# Altium project Controller.PrjPCB
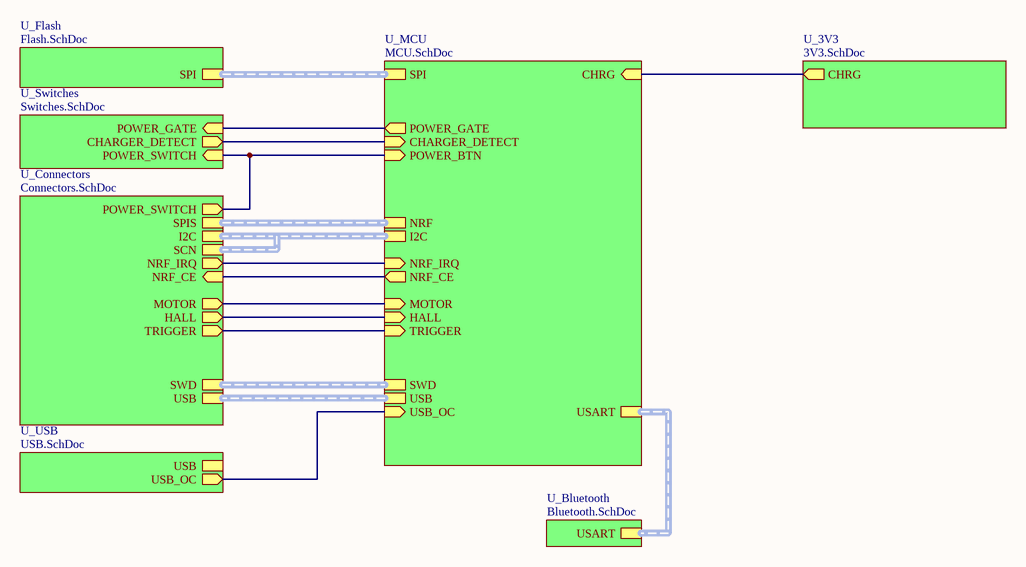
[diagram p0: Controller.SchDoc]
8 sheets, 109 parts. Net scope: hierarchical (ports join the sheet entries above them; power ports are global).
Board file: Controller.PcbDoc
Sheets:
  Controller.SchDoc
    U_3V3 = 3V3.SchDoc
    U_MCU = MCU.SchDoc
    U_Switches = Switches.SchDoc
    U_Connectors = Connectors.SchDoc
    U_Bluetooth = Bluetooth.SchDoc
    U_Flash = Flash.SchDoc
    U_USB = USB.SchDoc

## Sheet Controller.SchDoc
size A; SheetNumber: 1

### Sub-sheets
U_3V3 = 3V3.SchDoc: CHRG (out)
U_Bluetooth = Bluetooth.SchDoc: USART (harness USART2)
U_Connectors = Connectors.SchDoc: POWER_SWITCH (out), SWD (harness SWD), HALL (out), USB, SPIS (harness SPI), I2C (harness I2C), SCN (harness I2C), MOTOR (out), NRF_IRQ (out), NRF_CE (in), TRIGGER (out)
U_Flash = Flash.SchDoc: SPI (harness SPI)
U_MCU = MCU.SchDoc: POWER_BTN (in), POWER_GATE (out), USB (harness USB), I2C (harness I2C), USART (harness USART2), SPI, SWD (harness SWD), USB_OC (in), CHARGER_DETECT (in), NRF, HALL (in), MOTOR (in), NRF_IRQ (in), NRF_CE (out), TRIGGER (in), CHRG (in)
U_Switches = Switches.SchDoc: POWER_GATE (in), POWER_SWITCH (in), CHARGER_DETECT (out)
U_USB = USB.SchDoc: USB_OC (out), USB (harness USB)

### Nets
NetC2_2: sheet U_MCU/HALL, sheet U_Connectors/HALL
NetC15_2: sheet U_MCU/POWER_BTN, sheet U_Switches/POWER_SWITCH, sheet U_Connectors/POWER_SWITCH
NetC16_2: sheet U_MCU/TRIGGER, sheet U_Connectors/TRIGGER
NetD3_2: sheet U_MCU/MOTOR, sheet U_Connectors/MOTOR
NetD22_C: sheet U_MCU/USB_OC, sheet U_USB/USB_OC
NetJP1_3: sheet U_MCU/NRF_CE, sheet U_Connectors/NRF_CE
NetJP1_8: sheet U_MCU/NRF_IRQ, sheet U_Connectors/NRF_IRQ
NetQ4_1: sheet U_MCU/CHARGER_DETECT, sheet U_Switches/CHARGER_DETECT
NetQ11_1: sheet U_MCU/POWER_GATE, sheet U_Switches/POWER_GATE
NetR10_1: sheet U_3V3/CHRG, sheet U_MCU/CHRG

### Buses and harness runs
harness sheet U_Bluetooth/USART = sheet U_MCU/USART
harness sheet U_Connectors/I2C = sheet U_Connectors/SCN = sheet U_MCU/I2C
harness sheet U_Connectors/SPIS = sheet U_MCU/NRF
harness sheet U_Connectors/SWD = sheet U_MCU/SWD
harness sheet U_Connectors/USB = sheet U_MCU/USB
harness sheet U_Flash/SPI = sheet U_MCU/SPI

## Sheet 3V3.SchDoc
size A; SheetNumber: 2
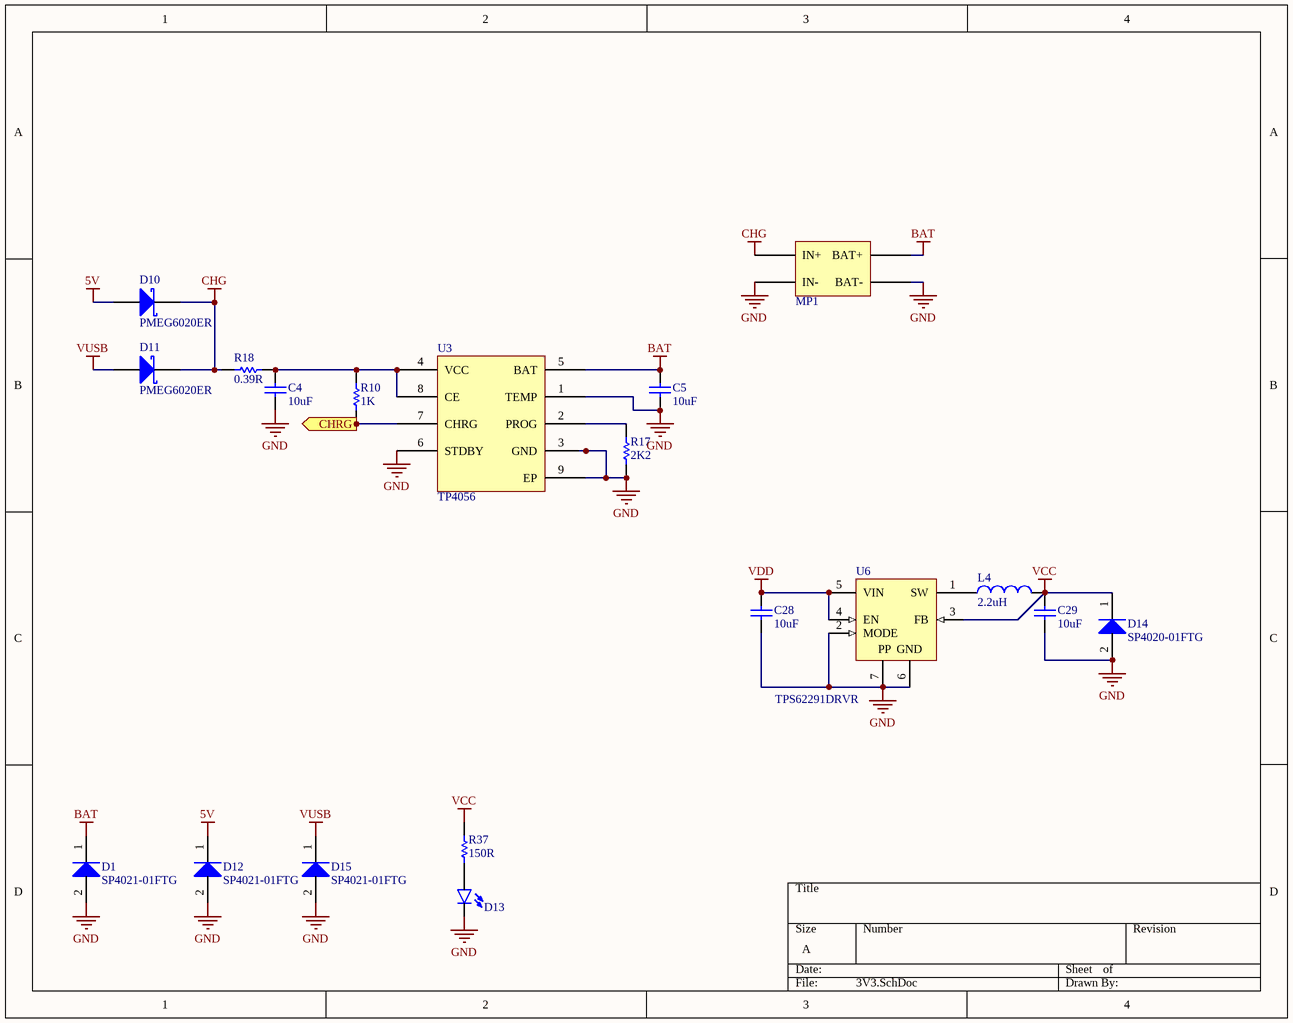
[diagram p1: 3V3.SchDoc]

### Parts
C4  value 10uF  [C1206[3216X160]]  (hidden comment: 10uF 50V 1206)
C5  value 10uF  [C1206[3216X160]]  (hidden comment: 10uF 50V 1206)
C28  value 10uF  [C0603[1608X92]]  (hidden comment: 10uF 16V 0603)
C29  value 10uF  [C0603[1608X92]]  (hidden comment: 10uF 6.3V 0603)
D1  SP4021-01FTG  [SOD-323]
D10  PMEG6020ER  [SOD-123]
D11  PMEG6020ER  [SOD-123]
D12  SP4021-01FTG  [SOD-323]
D13  LED_0603_GREEN_5mA  [LED0603]  (value not drawn)
D14  SP4020-01FTG  [SOD-323]
D15  SP4021-01FTG  [SOD-323]
L4  2.2uH  [IND0805]
MP1  Li-ion CHARGER  [LI-ION CHARGER]  (value not drawn)
R10  value 1K  [R0603[1608]]  (hidden comment: 1K 1% 0603)
R17  value 2K2  [R0603[1608]]  (hidden comment: 2K2 1% 0603)
R18  value 0.39R  [R1206[3216]]  (hidden comment: 0.39R 1% 1206)
R37  value 150R  [R0603[1608]]  (hidden comment: 150R 1% 0603)
U3  TP4056  [SOIC-8-EP]
U6  TPS62291DRVR  [WSON-6]

### Ports
CHRG (out)

### Nets
5V: D10.2(A) D12.1(K)
BAT: C5.2 D1.1(K) MP1.3(BAT+) U3.5(BAT)
CHG: D10.1(K) D11.1(K) MP1.1(IN+) R18.2
GND: C4.1 C5.1 C28.1 C29.1 D1.2(A) D12.2(A) D13.C D14.2(A) D15.2(A) MP1.2(IN-) MP1.4(BAT-) R17.1 U3.1(TEMP) U3.3(GND) U3.6(STDBY) U3.9(EP) U6.2(MODE) U6.6(GND) U6.7(EP)
VCC: C29.2 D14.1(K) L4.2 R37.2 U6.3(FB)
VDD: C28.2 U6.4(EN) U6.5(VIN)
VUSB: D11.2(A) D15.1(K)
NetC4_2: C4.2 R10.2 R18.1 U3.4(VCC) U3.8(CE)
NetD13_A: D13.A R37.1
NetL4_1: L4.1 U6.1(SW)
NetR10_1: R10.1 U3.7(CHRG) ; port CHRG
NetR17_2: R17.2 U3.2(PROG)

### Notes on the sheet
- (in symbol TPS62291DRVR) PP

### Library data of the parts
C4 C5 = CAP_10uF_50V_1206_20%: 10uF 50V 20% 1206 (3216 Metric); PartNumber: UMK316BBJ106ML-T; Manufacturer: Taiyo Yuden; Mounting Technology: Surface Mount; PackageReference: 1206; PackageDescription: 1206 (3216 Metric); Voltage: 50V; Tolerance: 20%
C28 = CAP_10uF_16V_0603_10%: 10uF 16V 10% 0603 (1608 Metric); PartNumber: GRM188R61C106KAALD; Manufacturer: Murata; TemperatureCoefficient: X5R; Mounting Technology: Surface Mount; PackageReference: 0603; PackageDescription: 0603 (1608 Metric); Voltage: 16V; Tolerance: 10%
C29 = CAP_10uF_6.3V_0603_10%: 10uF 6.3V 10% 0603 (1608 Metric); PartNumber: GRM188R60J106KE47D; Manufacturer: Murata; TemperatureCoefficient: X5R; Mounting Technology: Surface Mount; PackageReference: 0603; PackageDescription: 0603 (1608 Metric); Voltage: 6.3V; Tolerance: 10%
D1 D12 D15 = SP4021-01FTG: Manufacturer: Littelfuse; PartNumber: SP4021-01FTG; PackageReference: SOD-323-2; Mounting Technology: Surface Mount
D10 D11 = PMEG6020ER: PartNumber: PMEG6020ER,115; Manufacturer: NXP Semiconductors; PackageReference: SOD-123W; PackageDescription: SOD, 2-Leads, Body 2.69x1.6mm; Mounting Technology: Surface Mount
D13 = LED_0603_GREEN_5mA: PartNumber: LTST-C193TGKT-5A; Manufacturer: Lite-On Inc.; PackageReference: 0603; PackageDescription: 0603 (1608 Metric); Mounting Technology: Surface Mount
D14 = SP4020-01FTG: Manufacturer: Littelfuse; PartNumber: SP4020-01FTG; PackageReference: SOD-323-2; Mounting Technology: Surface Mount
L4 = IND_2.2uH_1.7A_0805_20%: 2.2uH 20% 1.7A 0805; PartNumber: LQM21PN2R2MGHL; Manufacturer: Murata; PackageReference: 0805; PackageDescription: 0805 (2012 metric); Value: 2.2uH; Mounting Technology: Surface Mount; Current: 1.7A
MP1 = Li-ion CHARGER: TP4056 LI-ION, LI-POLYMER 1-CELL CHARGER; Manufacturer: ELEPARTS; PartNumber: Micro USB 1A
R10 = RES_1K_0603_1%: 1K 0.25W 1% 0603 (1005 Metric); Manufacturer: Vishay / Dale; PartNumber: CRCW06031K00FKEAHP; Tolerance: 1%; Power: 0.25W; Mounting Technology: Surface Mount; PackageReference: 0603; PackageDescription: 0603 (1608 Metric); ComponentLink1Description: Datasheet; ComponentLink1URL: http://www.vishay.com/docs/20043/crcwhpe3.pdf
R17 = RES_2K2_0603_1%: 2K2 0.25W 1% 0603 (1005 Metric); Manufacturer: Vishay / Dale; PartNumber: CRCW06032K20FKEAHP; Tolerance: 1%; Power: 0.25W; Mounting Technology: Surface Mount; PackageReference: 0603; PackageDescription: 0603 (1608 Metric); ComponentLink1Description: Datasheet; ComponentLink1URL: http://www.vishay.com/docs/20043/crcwhpe3.pdf
R18 = RES_0.39R_1206_1%: 0.39R 0.5W 1% 1206 (3216 Metric); Manufacturer: Vishay Dale; PartNumber: RCWE1206R390FKEA; Tolerance: 1%; Power: 0.5W; Mounting Technology: Surface Mount; PackageReference: 1206; PackageDescription: 1206 (3216 Metric); ComponentLink1Description: Datasheet; ComponentLink1URL: https://industrial.panasonic.com/cdbs/www-data/pdf/RDA0000/AOA0000C239.pdf
R37 = RES_150R_0603_1%: 150R 0.25W 1% 0603 (1005 Metric); Manufacturer: Vishay / Dale; PartNumber: CRCW0603150RFKEAHP; Tolerance: 1%; Power: 0.25W; Mounting Technology: Surface Mount; PackageReference: 0603; PackageDescription: 0603 (1608 Metric); ComponentLink1Description: Datasheet; ComponentLink1URL: http://www.vishay.com/docs/20043/crcwhpe3.pdf
U3 = TP4056: 1 CELL Li-ion Battery Charger; Manufacturer: Nanjing Extension Microelectronics; PartNumber: TP4056; PackageReference: SOP-8; Mounting Technology: Surface Mount
U6 = TPS62291DRVR: Voltage Regulators - Switching Regulators 2.25MHz 1A Step-Down Cnvrtr 3.3V Output; Manufacturer: Texas Instruments; PartNumber: TPS62291DRVR; PackageReference: WSON-6; PackageDescription: SON, 6-Leads, Body 2x2mm, Pitch 0.65mm, Thermal Pad 1.6x1mm, TI Recommended; Mounting Technology: Surface Mount

## Sheet MCU.SchDoc
size A3; SheetNumber: 3
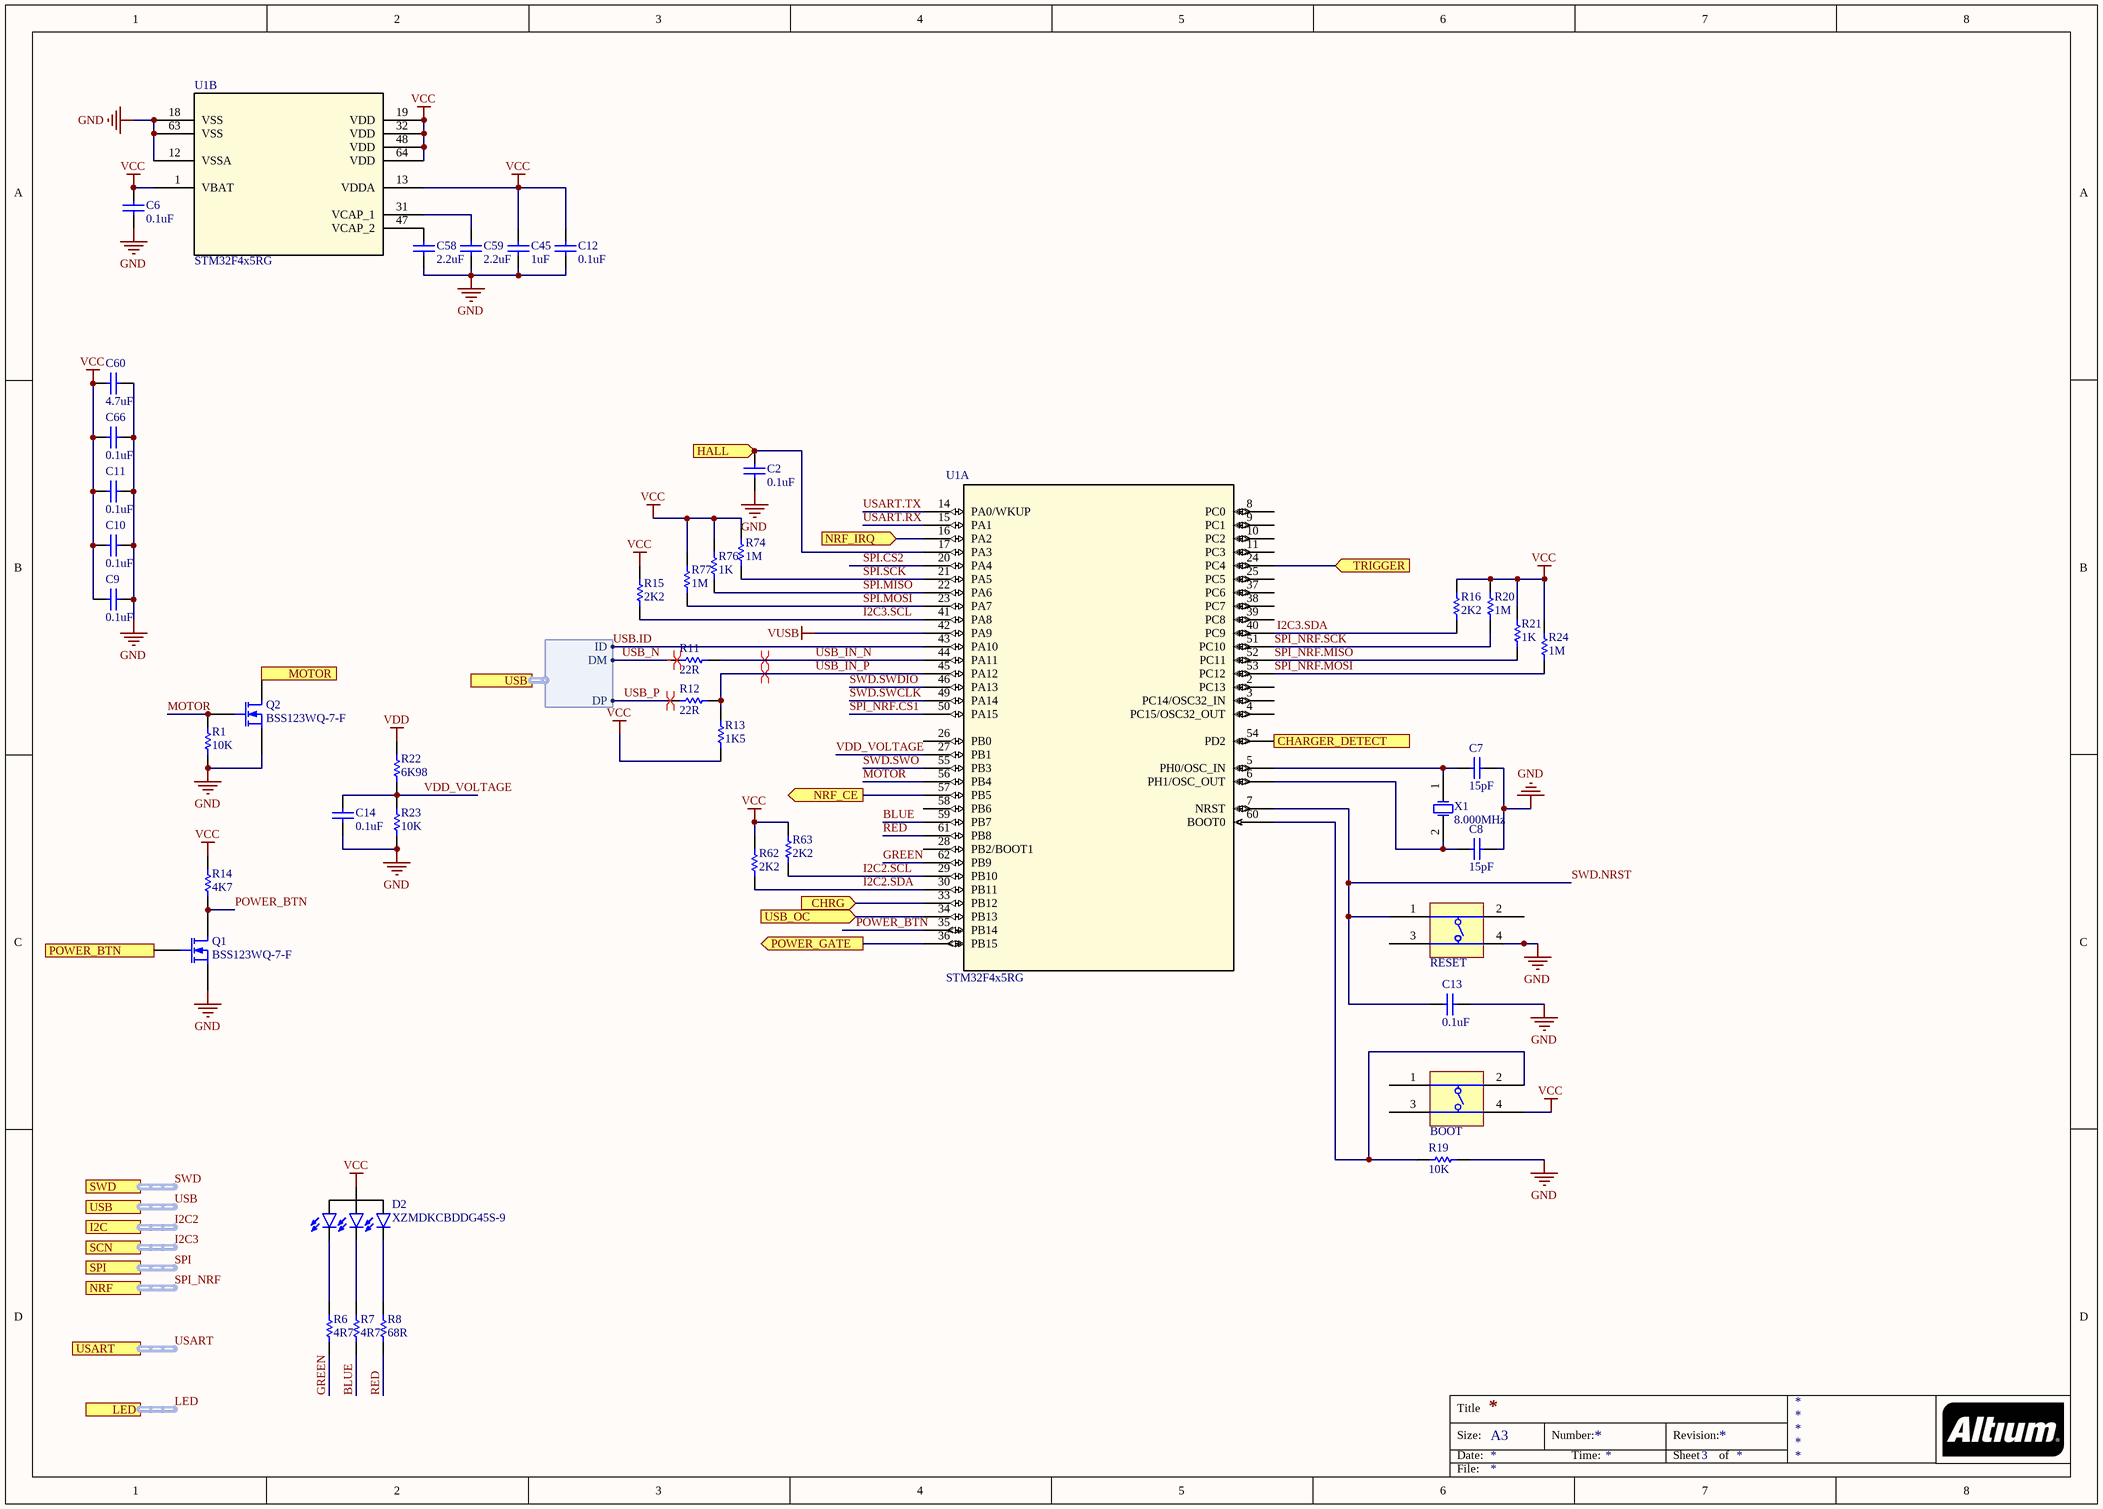
[diagram p2: MCU.SchDoc]

### Parts
BOOT  DIPT-DTSM-6  [SWITCH]  (value not drawn)
C2  value 0.1uF  [C0603[1608X92]]  (hidden comment: 0.1uF 6.3V 0603)
C6  value 0.1uF  [C0603[1608X92]]  (hidden comment: 0.1uF 6.3V 0603)
C7  value 15pF  [C0603[1608X92]]  (hidden comment: 15pF 50V 0603)
C8  value 15pF  [C0603[1608X92]]  (hidden comment: 15pF 50V 0603)
C9  value 0.1uF  [C0603[1608X92]]  (hidden comment: 0.1uF 6.3V 0603)
C10  value 0.1uF  [C0603[1608X92]]  (hidden comment: 0.1uF 6.3V 0603)
C11  value 0.1uF  [C0603[1608X92]]  (hidden comment: 0.1uF 6.3V 0603)
C12  value 0.1uF  [C0603[1608X92]]  (hidden comment: 0.1uF 6.3V 0603)
C13  value 0.1uF  [C0603[1608X92]]  (hidden comment: 0.1uF 6.3V 0603)
C14  value 0.1uF  [C0603[1608X92]]  (hidden comment: 0.1uF 6.3V 0603)
C45  value 1uF  [C0603[1608X92]]  (hidden comment: 1uF 6.3V 0603)
C58  value 2.2uF  [C1206[3216X160]]  (hidden comment: 2.2uF 6.3V 1206)
C59  value 2.2uF  [C1206[3216X160]]  (hidden comment: 2.2uF 6.3V 1206)
C60  value 4.7uF  [C0603[1608X92]]  (hidden comment: 4.7uF 6.3V 0603)
C66  value 0.1uF  [C0603[1608X92]]  (hidden comment: 0.1uF 6.3V 0603)
D2  XZMDKCBDDG45S-9  [XZMDKCBDDG45S-9]
Q1  BSS123WQ-7-F  [SOT323-3]
Q2  BSS123WQ-7-F  [SOT323-3]
R1  value 10K  [R0603[1608]]  (hidden comment: 10K 1% 0603)
R6  value 4R7  [R0603[1608]]  (hidden comment: 4R7 5% 0603)
R7  value 4R7  [R0603[1608]]  (hidden comment: 4R7 5% 0603)
R8  value 68R  [R0603[1608]]  (hidden comment: 68R 1% 0603)
R11  value 22R  [R0603[1608]]  (hidden comment: 22R 1% 0603)
R12  value 22R  [R0603[1608]]  (hidden comment: 22R 1% 0603)
R13  value 1K5  [R0603[1608]]  (hidden comment: 1K5 1% 0603)
R14  value 4K7  [R0603[1608]]  (hidden comment: 4K7 1% 0603)
R15  value 2K2  [R0603[1608]]  (hidden comment: 2K2 1% 0603)
R16  value 2K2  [R0603[1608]]  (hidden comment: 2K2 1% 0603)
R19  value 10K  [R0603[1608]]  (hidden comment: 10K 1% 0603)
R20  value 1M  [R0603[1608]]  (hidden comment: 1M 5% 0603)
R21  value 1K  [R0603[1608]]  (hidden comment: 1K 1% 0603)
R22  value 6K98  [R0603[1608]]  (hidden comment: 6K98 1% 0603)
R23  value 10K  [R0603[1608]]  (hidden comment: 10K 1% 0603)
R24  value 1M  [R0603[1608]]  (hidden comment: 1M 5% 0603)
R62  value 2K2  [R0603[1608]]  (hidden comment: 2K2 1% 0603)
R63  value 2K2  [R0603[1608]]  (hidden comment: 2K2 1% 0603)
R74  value 1M  [R0603[1608]]  (hidden comment: 1M 5% 0603)
R76  value 1K  [R0603[1608]]  (hidden comment: 1K 1% 0603)
R77  value 1M  [R0603[1608]]  (hidden comment: 1M 5% 0603)
RESET  DIPT-DTSM-6  [SWITCH]  (value not drawn)
U1  STM32F4x5RG  [LQFP64-10x10mm]  (parts A,B of 2)
X1  8.000MHz  [OSC_2SM_3R2x2R5]

### Ports
CHARGER_DETECT (in), CHRG (in), HALL (in), I2C (harness I2C), LED (harness LED), MOTOR (in), NRF (harness SPI), NRF_CE (out), NRF_IRQ (in), POWER_BTN (in), POWER_GATE (out), SCN (harness I2C), SPI (harness SPI), SWD (harness SWD), TRIGGER (in), USART (harness USART2), USB (harness USB), USB_OC (in)

### Harnesses
USB: DM, DP, ID

### Nets
GND: C2.1 C6.1 C7.2 C8.2 C9.2 C10.2 C11.2 C12.1 C13.2 C14.1 C45.1 C58.1 C59.1 C60.2 C66.2 Q1.2(S) Q2.2(S) R1.1 R19.2 R23.1 RESET.4 U1.12(VSSA) U1.18(VSS) U1.63(VSS)
VCC: BOOT.4 C6.2 C9.1 C10.1 C11.1 C12.2 C45.2 C60.1 C66.1 D2.2(A) R13.1 R14.2 R15.1 R16.1 R20.1 R21.1 R24.1 R62.1 R63.1 R74.1 R76.1 R77.1 U1.1(VBAT) U1.13(VDDA) U1.19(VDD) U1.32(VDD) U1.48(VDD) U1.64(VDD)
VDD: R22.2
VUSB: U1.42(PA9)
BLUE: R7.1 U1.59(PB7)
GREEN: R6.1 U1.62(PB9)
I2C2.SCL: R63.2 U1.29(PB10)
I2C2.SDA: R62.2 U1.30(PB11)
I2C3.SCL: R15.2 U1.41(PA8)
I2C3.SDA: R16.2 U1.40(PC9)
MOTOR: Q2.1(G) R1.2 U1.56(PB4)
POWER_BTN: Q1.3(D) R14.1 U1.35(PB14)
RED: R8.1 U1.61(PB8)
SPI.CS2: U1.20(PA4)
SPI.MISO: R76.2 U1.22(PA6)
SPI.MOSI: R77.2 U1.23(PA7)
SPI.SCK: R74.2 U1.21(PA5)
SPI_NRF.CS1: U1.50(PA15)
SPI_NRF.MISO: R21.2 U1.52(PC11)
SPI_NRF.MOSI: R24.2 U1.53(PC12)
SPI_NRF.SCK: R20.2 U1.51(PC10)
SWD.NRST: C13.1 RESET.1 U1.7(NRST)
SWD.SWCLK: U1.49(PA14)
SWD.SWDIO: U1.46(PA13)
SWD.SWO: U1.55(PB3)
USART.RX: U1.15(PA1)
USART.TX: U1.14(PA0/WKUP)
USB.ID: U1.43(PA10) ; port USB.ID
USB_IN_N: R11.2 U1.44(PA11)
USB_IN_P: R12.2 R13.2 U1.45(PA12)
USB_N: R11.1 ; port USB.DM  [project net USB.DM]
USB_P: R12.1 ; port USB.DP  [project net USB.DP]
VDD_VOLTAGE: C14.2 R22.1 R23.2 U1.27(PB1)
NetBOOT_2: BOOT.2 R19.1 U1.60(BOOT0)
NetC2_2: C2.2 U1.17(PA3) ; port HALL
NetC7_1: C7.1 U1.5(PH0/OSC_IN) X1.1(OSC1)
NetC8_1: C8.1 U1.6(PH1/OSC_OUT) X1.2(OSC2)
NetC15_2: Q1.1(G) ; port POWER_BTN
NetC16_2: U1.24(PC4) ; port TRIGGER
NetC58_2: C58.2 U1.47(VCAP_2)
NetC59_2: C59.2 U1.31(VCAP_1)
NetD2_1: D2.1(K_Red) R8.2
NetD2_3: D2.3(K_Blue) R7.2
NetD2_4: D2.4(K_Green) R6.2
NetD3_2: Q2.3(D) ; port MOTOR
NetD22_C: U1.34(PB13) ; port USB_OC
NetJP1_3: U1.57(PB5) ; port NRF_CE
NetJP1_8: U1.16(PA2) ; port NRF_IRQ
NetQ4_1: U1.54(PD2) ; port CHARGER_DETECT
NetQ11_1: U1.36(PB15) ; port POWER_GATE
NetR10_1: U1.33(PB12) ; port CHRG

Not connected (* = marked no-connect by the designer): BOOT 1 3; RESET 2 3; U1 2(PC13) 3(PC14/OSC32_IN) 4(PC15/OSC32_OUT) 8(PC0) 9(PC1) 10(PC2) 11(PC3) 25(PC5) 26(PB0) 28(PB2/BOOT1) 37(PC6) 38(PC7) 39(PC8) 58(PB6)

### Buses and harness runs
harness I2C2 = port I2C
harness I2C3 = port SCN
harness LED = port LED
harness SPI = port SPI
harness SPI_NRF = port NRF
harness SWD = port SWD
harness USART = port USART
harness USB = port USB

### Layout directives
differential pair; rule Width Constraint [Pref Width = 10mil    Min Width = 10mil    Max Width = 10mil]: USB.DM
differential pair: USB.DP, USB_IN_N, USB_IN_P

### Notes on the sheet
- Title
- Size:
- Date:
- A3
- Number:
- Time:
- Revision:
- Sheet
- of
- File:

### Library data of the parts
BOOT RESET = DIPT-DTSM-6: Switch, SPNO Push Button SMD; Manufacturer: C&K Components; PartNumber: PTS810 SJM 250 SMTR LFS; PackageReference: PTS810
C2 C6 C9-C14 C66 = CAP_0.1uF_6.3V_0603_10%: 0.1uF 6.3V 10% 0603 (1608 Metric); PartNumber: GRM188R70J104KA01D; Manufacturer: Murata; Mounting Technology: Surface Mount; PackageReference: 0603; PackageDescription: 0603 (1608 Metric); Voltage: 6.3V; Tolerance: 10%
C7 C8 = CAP_15pF_50V_0603_1%: 15pF 50V 1% 0603 (1608 Metric); PartNumber: 06035A150FAT2A; Manufacturer: AVX Corporation; TemperatureCoefficient: C0G; Mounting Technology: Surface Mount; PackageReference: 0603; PackageDescription: 0603 (1608 Metric); Voltage: 50V; Tolerance: 1%
C45 = CAP_1uF_6.3V_0603_10%: 1uF 6.3V 10% 0603 (1608 Metric); PartNumber: GRM188R60J105KA01D; Manufacturer: Murata; TemperatureCoefficient: X5R; Mounting Technology: Surface Mount; PackageReference: 0603; PackageDescription: 0603 (1608 Metric); Voltage: 6.3V; Tolerance: 10%
C58 C59 = CAP_2.2uF_16V_1206_10%: 2.2uF 6.3V 10% 1206 (3216 Metric); PartNumber: C1206C225K4PACTU; Manufacturer: KEMET; Voltage: 16V; Mounting Technology: Surface Mount; PackageReference: 1206; PackageDescription: 1206 (3216 Metric); Tolerance: 10%
C60 = CAP_4.7uF_6.3V_0603_10%: 4.7uF 6.3V 10% 0603 (1608 Metric); PartNumber: GRM188R60J475KE19J; Manufacturer: Murata; TemperatureCoefficient: X5R; Mounting Technology: Surface Mount; PackageReference: 0603; PackageDescription: 0603 (1608 Metric); Voltage: 6.3V; Tolerance: 10%
D2 = XZMDKCBDDG45S-9: Manufacturer: SunLED; PartNumber: XZMDKCBDDG45S-9; PackageReference: 4-PLCC; Mounting Technology: Surface Mount; PackageDescription: 4-SMD, Gull Wing,  3.20mm L x 2.80mm W
Q1 Q2 = BSS123WQ-7-F: N-Channel MOSFET; Manufacturer: Diodes Incorporated; PackageReference: SOT-323-3; PartNumber: BSS123WQ-7-F; Mounting Technology: Surface Mount
R1 R19 R23 = RES_10K_0603_1%: 10K 0.25W 1% 0603 (1005 Metric); Manufacturer: Vishay / Dale; PartNumber: CRCW060310K0FKEAHP; Power: 0.25W; Tolerance: 1%; Mounting Technology: Surface Mount; PackageReference: 0603; PackageDescription: 0603 (1608 Metric); ComponentLink1Description: Datasheet; ComponentLink1URL: http://www.vishay.com/docs/20065/rcse3.pdf
R6 R7 = RES_4R7_0603_5%: 4R7 0.25W 5% 0603 (1005 Metric); Manufacturer: Rohm; PartNumber: ESR03EZPJ4R7; Tolerance: 5%; Power: 0.25W; Mounting Technology: Surface Mount; PackageReference: 0603; PackageDescription: 0603 (1608 Metric); ComponentLink1Description: Datasheet; ComponentLink1URL: http://www.vishay.com/docs/20043/crcwhpe3.pdf
R8 = RES_68R_0603_1%: 68R 0.25W 1% 0603 (1005 Metric); Manufacturer: Panasonic; PartNumber: ERJ-PA3F68R0V; Tolerance: 1%; Power: 0.25W; Mounting Technology: Surface Mount; PackageReference: 0603; PackageDescription: 0603 (1608 Metric); ComponentLink1Description: Datasheet; ComponentLink1URL: http://www.vishay.com/docs/20043/crcwhpe3.pdf
R11 R12 = RES_22R_0603_1%: 22R 0.25W 1% 0603 (1005 Metric); Manufacturer: Vishay / Dale; PartNumber: CRCW060322R0FKEAHP; Tolerance: 1%; Power: 0.25W; Mounting Technology: Surface Mount; PackageReference: 0603; PackageDescription: 0603 (1608 Metric); ComponentLink1Description: Datasheet; ComponentLink1URL: http://www.vishay.com/docs/20043/crcwhpe3.pdf
R13 = RES_1K5_0603_1%: 1K5 0.25W 1% 0603 (1005 Metric); Manufacturer: Vishay / Dale; PartNumber: CRCW06031K50FKEAHP; Tolerance: 1%; Power: 0.25W; Mounting Technology: Surface Mount; PackageReference: 0603; PackageDescription: 0603 (1608 Metric); ComponentLink1Description: Datasheet; ComponentLink1URL: http://www.vishay.com/docs/20043/crcwhpe3.pdf
R14 = RES_4K7_0603_1%: 4K7 0.25W 1% 0603 (1005 Metric); Manufacturer: Vishay / Dale; PartNumber: CRCW06034K70FKEAHP; Tolerance: 1%; Power: 0.25W; Mounting Technology: Surface Mount; PackageReference: 0603; PackageDescription: 0603 (1608 Metric); ComponentLink1Description: Datasheet; ComponentLink1URL: http://www.vishay.com/docs/20043/crcwhpe3.pdf
R15 R16 R62 R63 = RES_2K2_0603_1%: as R17 on sheet 3V3; Tolerance: 1%; Power: 0.25W; Mounting Technology: Surface Mount; PackageReference: 0603; PackageDescription: 0603 (1608 Metric); ComponentLink1Description: Datasheet; ComponentLink1URL: http://www.vishay.com/docs/20043/crcwhpe3.pdf
R20 R24 R74 R77 = RES_1M_0603_5%: 1M 0.25W 5% 0603 (1005 Metric); Manufacturer: Panasonic; PartNumber: ERJ-PA3J105V; Tolerance: 5%; Power: 0.25W; Mounting Technology: Surface Mount; PackageReference: 0603; PackageDescription: 0603 (1608 Metric); ComponentLink1Description: Datasheet; ComponentLink1URL: http://www.vishay.com/docs/20043/crcwhpe3.pdf
R21 R76 = RES_1K_0603_1%: as R10 on sheet 3V3; Tolerance: 1%; Power: 0.25W; Mounting Technology: Surface Mount; PackageReference: 0603; PackageDescription: 0603 (1608 Metric); ComponentLink1Description: Datasheet; ComponentLink1URL: http://www.vishay.com/docs/20043/crcwhpe3.pdf
R22 = RES_6K98_0603_1%: 6K98 0.25W 1% 0603 (1005 Metric); Manufacturer: Vishay / Dale; PartNumber: CRCW06036K98FKEAHP; Tolerance: 1%; Power: 0.25W; Mounting Technology: Surface Mount; PackageReference: 0603; PackageDescription: 0603 (1608 Metric); ComponentLink1Description: Datasheet; ComponentLink1URL: http://www.vishay.com/docs/20043/crcwhpe3.pdf
U1 = STM32F4x5RG: Imported; PartNumber: STM32F405RG; Vendor: STMicroelectronics; Value: Value; Type: Type; RefDes: RefDes; Manufacturer: STMicroelectronics
X1 = XTAL_NX3225GD_8MHZ: Crystal Oscillator; Manufacturer: NX; PartNumber: NX3225GD-8MHZ-STD-CRA-3; PackageReference: 2-SMD; Value: 8.000MHz

## Sheet Switches.SchDoc
size A; SheetNumber: 7
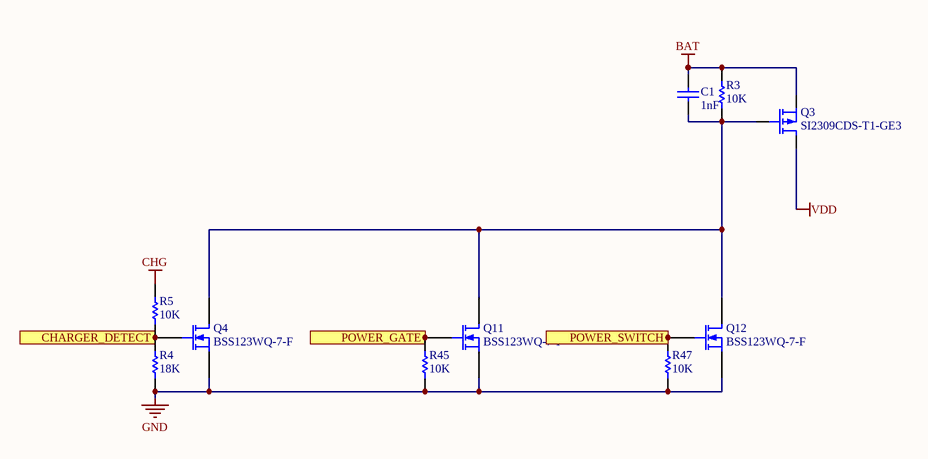
[diagram p3: Switches.SchDoc]

### Parts
C1  value 1nF  [C0603[1608X92]]  (hidden comment: 1nF 50V 0603)
Q3  SI2309CDS-T1-GE3  [SOT23-3]
Q4  BSS123WQ-7-F  [SOT323-3]
Q11  BSS123WQ-7-F  [SOT323-3]
Q12  BSS123WQ-7-F  [SOT323-3]
R3  value 10K  [R0603[1608]]  (hidden comment: 10K 1% 0603)
R4  value 18K  [R0603[1608]]  (hidden comment: 18K 1% 0603)
R5  value 10K  [R0603[1608]]  (hidden comment: 10K 1% 0603)
R45  value 10K  [R0603[1608]]  (hidden comment: 10K 1% 0603)
R47  value 10K  [R0603[1608]]  (hidden comment: 10K 1% 0603)

### Ports
CHARGER_DETECT (out), POWER_GATE (in), POWER_SWITCH (in)

### Nets
BAT: C1.2 Q3.3(S) R3.2
CHG: R5.2
GND: Q4.2(S) Q11.2(S) Q12.2(S) R4.1 R45.1 R47.1
VDD: Q3.2(D)
NetC1_1: C1.1 Q3.1(G) Q4.3(D) Q11.3(D) Q12.3(D) R3.1
NetC15_2: Q12.1(G) R47.2 ; port POWER_SWITCH
NetQ4_1: Q4.1(G) R4.2 R5.1 ; port CHARGER_DETECT
NetQ11_1: Q11.1(G) R45.2 ; port POWER_GATE

### Library data of the parts
C1 = CAP_1nF_50V_0603_5%: 1nF 50V 5% 0603 (1608 Metric); PartNumber: GRM1885C1H102JA01D; Manufacturer: Murata; TemperatureCoefficient: C0G; Mounting Technology: Surface Mount; PackageReference: 0603; PackageDescription: 0603 (1608 Metric); Voltage: 50V; Tolerance: 5%
Q3 = SI2309CDS-T1-GE3: P-Channel MOSFET; Manufacturer: Vishay; PackageReference: SOT23-3; Mounting Technology: Surface Mount; PartNumber: SI2309CDS-T1-GE3
Q4 Q11 Q12 = BSS123WQ-7-F: as Q1 on sheet MCU; PackageReference: SOT-323-3; PartNumber: BSS123WQ-7-F; Mounting Technology: Surface Mount
R3 R5 R45 R47 = RES_10K_0603_1%: as R1 on sheet MCU; Power: 0.25W; Tolerance: 1%; Mounting Technology: Surface Mount; PackageReference: 0603; PackageDescription: 0603 (1608 Metric); ComponentLink1Description: Datasheet; ComponentLink1URL: http://www.vishay.com/docs/20065/rcse3.pdf
R4 = RES_18K_0603_1%: 18K 0.25W 1% 0603 (1005 Metric); Manufacturer: Vishay / Dale; PartNumber: CRCW060318K0FKEAHP; Tolerance: 1%; Power: 0.25W; Mounting Technology: Surface Mount; PackageReference: 0603; PackageDescription: 0603 (1608 Metric); ComponentLink1Description: Datasheet; ComponentLink1URL: http://www.vishay.com/docs/20043/crcwhpe3.pdf

## Sheet Connectors.SchDoc
size A; SheetNumber: 13
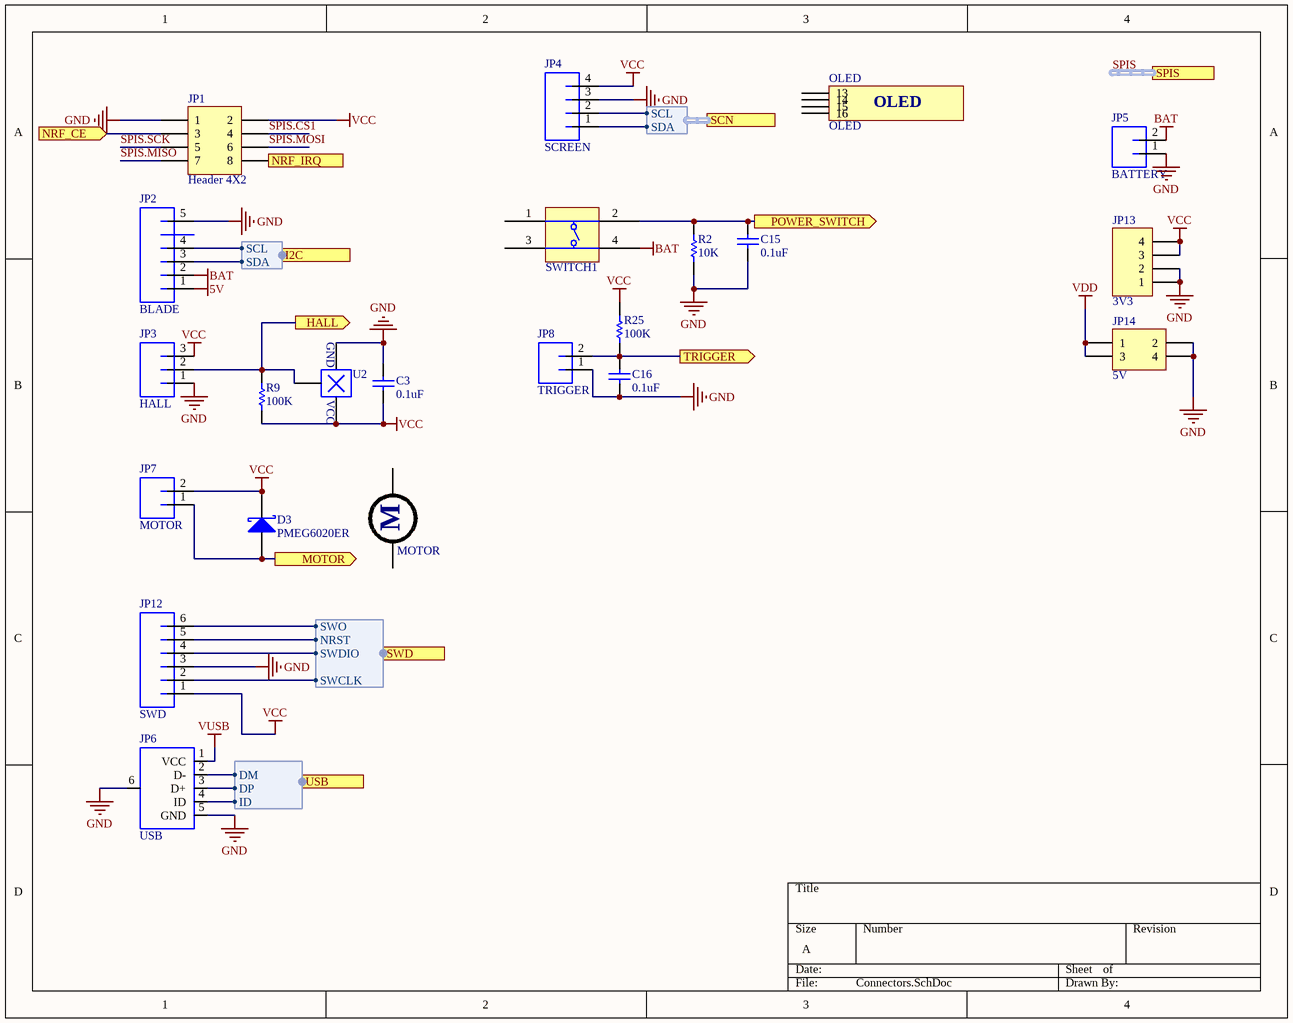
[diagram p4: Connectors.SchDoc]

### Parts
(Parts that share a designator on the sheet are numbered #1, #2 ... from top to bottom, then left to right.)
*  MOTOR  (mechanical)
C3  value 0.1uF  [C0603[1608X92]]  (hidden comment: 0.1uF 6.3V 0603)
C15  value 0.1uF  [C0603[1608X92]]  (hidden comment: 0.1uF 6.3V 0603)
C16  value 0.1uF  [C0603[1608X92]]  (hidden comment: 0.1uF 6.3V 0603)
D3  PMEG6020ER  [SOD-123]
JP1  Header 4X2  [HDR2X4]
JP2  BLADE  [TE_1473971-2]
JP3  HALL  [JST-PH-3-PTH-HORZ]
JP4  SCREEN  [JST-PH-4-PTH-HORZ]
JP5  BATTERY  [JST-PH-2-PTH-HORZ]
JP6#1  USB  [USB-MICROB_HORZ]
JP7  MOTOR  [JST-PH-2-PTH-HORZ]
JP8  TRIGGER  [JST-PH-2-PTH-HORZ]
JP12  SWD  [MOLEX_5045_6]
JP13  3V3  [HDR1X4]
JP14  5V  [HDR2X2]
OLED  OLED
R2  value 10K  [R0603[1608]]  (hidden comment: 10K 1% 0603)
R9  value 100K  [R0603[1608]]  (hidden comment: 100K 1% 0603)
R25  value 100K  [R0603[1608]]  (hidden comment: 100K 1% 0603)
SWITCH1  DIPT-DTSM-6  [SWITCH]  (value not drawn)
U2  HALL_SENSOR  [SOT23-3]  (value not drawn)

### Ports
HALL (out), I2C (harness I2C), MOTOR (out), NRF_CE (in), NRF_IRQ (out), POWER_SWITCH (out), SCN (harness I2C), SPIS (harness SPI), SWD (harness SWD), TRIGGER (out), USB (harness USB)

### Harnesses
USB: DM, DP, ID
SWD: SWCLK, SWDIO, SWO, NRST
I2C: SCL, SDA

### Nets
5V: JP2.1
BAT: JP2.2 JP5.2 SWITCH1.4
GND: C3.2 C15.1 C16.1 JP1.1 JP2.5 JP3.1 JP4.3 JP5.1 JP6#1.5(GND) JP6#1.6(SHIELD) JP8.1 JP12.3 JP13.1 JP13.2 JP14.2 JP14.4 R2.1 U2.2(GND)
VCC: C3.1 D3.1(K) JP1.2 JP3.3 JP4.4 JP7.2 JP12.1 JP13.3 JP13.4 R9.1 R25.2 U2.1(VCC)
VDD: JP14.1 JP14.3
VUSB: JP6#1.1(VCC)
I2C2.SCL: JP2.4 JP4.2 ; port I2C.SCL
I2C2.SDA: JP2.3 JP4.1 ; port I2C.SDA
SPIS.CS1: JP1.4
SPIS.MISO: JP1.7
SPIS.MOSI: JP1.6
SPIS.SCK: JP1.5
SWD.NRST: JP12.5 ; port SWD.NRST
SWD.SWCLK: JP12.2 ; port SWD.SWCLK
SWD.SWDIO: JP12.4 ; port SWD.SWDIO
SWD.SWO: JP12.6 ; port SWD.SWO
USB.DM: JP6#1.2(D-) ; port USB.DM
USB.DP: JP6#1.3(D+) ; port USB.DP
USB.ID: JP6#1.4(ID) ; port USB.ID
NetC2_2: JP3.2 R9.2 U2.3(OUT) ; port HALL
NetC15_2: C15.2 R2.2 SWITCH1.2 ; port POWER_SWITCH
NetC16_2: C16.2 JP8.2 R25.1 ; port TRIGGER
NetD3_2: D3.2(A) JP7.1 ; port MOTOR
NetJP1_3: JP1.3 ; port NRF_CE
NetJP1_8: JP1.8 ; port NRF_IRQ

Not connected (* = marked no-connect by the designer): * 15 16; OLED 13 14 15 16; SWITCH1 1 3

### Buses and harness runs
harness SPIS = port SPIS

### Notes on the sheet
- (in symbol MOTOR) M

### Library data of the parts
* = MOTOR: PartNumber: 316040001; Manufacturer: SEEED
C3 C15 C16 = CAP_0.1uF_6.3V_0603_10%: as C2 on sheet MCU; Mounting Technology: Surface Mount; PackageReference: 0603; PackageDescription: 0603 (1608 Metric); Voltage: 6.3V; Tolerance: 10%
D3 = PMEG6020ER: as D10 on sheet 3V3; PackageDescription: SOD, 2-Leads, Body 2.69x1.6mm; PackageReference: SOD-123W; Mounting Technology: Surface Mount
JP1 = Header 4X2: Header, 4-Pin, Dual row; LatestRevisionDate: 17-Jul-2002; LatestRevisionNote: Re-released for DXP Platform.; Publisher: Altium Limited
JP2 = TE_MDI_1473971-2: BLADE CONNECTOR, 5 PIN, FEMALE, HORIZ; Manufacturer: TE Connectivity; PartNumber: 1473971-2; Mounting Technology: Through Hole
JP3 = JST_PH_3_HORZ: Manufacturer: JST Sales America Inc.; PartNumber: B3B-PH-K-S(LF)(SN); Mounting Technology: Through Hole; PackageReference: JST-PH
JP4 = JST_PH_4_HORZ: PartNumber: S4B-PH-K-S(LF)(SN); Manufacturer: JST Sales America Inc.; PackageReference: JST-PH; Mounting Technology: Through Hole
JP5 JP7 JP8 = JST_PH_2_HORZ: Manufacturer: JST Sales America Inc.; PartNumber: B2B-PH-K-S(LF)(SN); Mounting Technology: Through Hole; PackageReference: JST-PH
JP6#1 = USB_MICROB_HORZ: pin to pad: 1>VBUS 2>D- 3>D+ 4>ID 5>GND 6>MT1+P$1+P$2+MT2; PartNumber: 10118192-0001LF; Manufacturer: Amphenol FCI; Mounting Technology: Surface Mount; PackageReference: USB - Micro B
JP12 = MOLEX_5045_6: PartNumber: B6B-PH-K-S(LF)(SN); Manufacturer: JST Sales America Inc.; PackageReference: JST-PH; Mounting Technology: Through Hole
JP13 = Header 4: Header, 4-Pin; LatestRevisionDate: 17-Jul-2002; LatestRevisionNote: Re-released for DXP Platform.; Publisher: Altium Limited
JP14 = Header 2X2: Header, 2-Pin, Dual row; LatestRevisionDate: 17-Jul-2002; LatestRevisionNote: Re-released for DXP Platform.; Publisher: Altium Limited
OLED = OLED: PartNumber: 0.91inch OLED Module; Manufacturer: Waveshare
R2 = RES_10K_0603_1%: as R1 on sheet MCU; Tolerance: 1%; Power: 0.25W; Mounting Technology: Surface Mount; PackageReference: 0603; PackageDescription: 0603 (1608 Metric); ComponentLink1Description: Datasheet; ComponentLink1URL: http://www.vishay.com/docs/20065/rcse3.pdf
R9 R25 = RES_100K_0603_1%: 100K 0.25W 1% 0603 (1005 Metric); Manufacturer: Vishay / Dale; PartNumber: CRCW0603100KFKEAHP; Tolerance: 1%; Power: 0.25W; Mounting Technology: Surface Mount; PackageReference: 0603; PackageDescription: 0603 (1608 Metric); ComponentLink1Description: Datasheet; ComponentLink1URL: http://www.vishay.com/docs/20043/crcwhpe3.pdf
SWITCH1 = DIPT-DTSM-6: as BOOT on sheet MCU; PackageReference: PTS810
U2 = HALL_SENSOR: PartNumber: DRV5055A2; Manufacturer: Texas Instruments; Mounting Technology: Surface Mount; PackageReference: 2012; PackageDescription: SOT-23-3

## Sheet Bluetooth.SchDoc
size A4
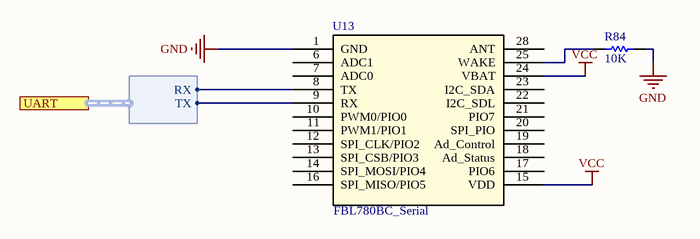
[diagram p5: Bluetooth.SchDoc]

### Parts
R84  value 10K  [R0603[1608]]  (hidden comment: 10K 1% 0603)
U13  FBL780BC_Serial  [FBL780BC_Serial]

### Ports
UART (harness USART2)

### Harnesses
USART2: TX, RX

### Nets
GND: R84.2 U13.1(GND)
VCC: U13.15(VDD) U13.24(VBAT)
NetR84_1: R84.1 U13.25(WAKE)
NetU13_8: U13.8(TX) ; port UART.RX
NetU13_9: U13.9(RX) ; port UART.TX

Not connected (* = marked no-connect by the designer): U13 6(ADC1) 7(ADC0) 10(PWM0/PIO0) 11(PWM1/PIO1) 12(SPI_CLK/PIO2) 13(SPI_CSB/PIO3) 14(SPI_MOSI/PIO4) 16(SPI_MISO/PIO5) 17(PIO6) 18(Ad_Status) 19(Ad_Control) 20(SPI_PIO) 21(PIO7) 22(I2C_SDL) 23(I2C_SDA) 28(ANT)

### Library data of the parts
R84 = RES_10K_0603_1%: as R1 on sheet MCU; Tolerance: 1%; Power: 0.25W; Mounting Technology: Surface Mount; PackageReference: 0603; PackageDescription: 0603 (1608 Metric); ComponentLink1Description: Datasheet; ComponentLink1URL: http://www.vishay.com/docs/20065/rcse3.pdf
U13 = FBL780BC_Serial: Manufacturer: Firmtech; PartNumber: FBL780BC_Serial

## Sheet Flash.SchDoc
size A; SheetNumber: 12
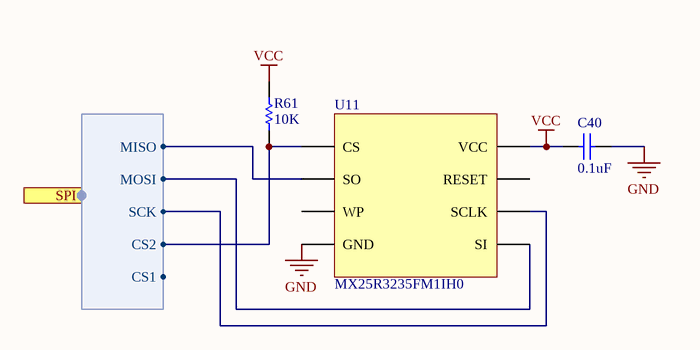
[diagram p6: Flash.SchDoc]

### Parts
C40  value 0.1uF  [C0603[1608X92]]  (hidden comment: 0.1uF 6.3V 0603)
R61  value 10K  [R0603[1608]]  (hidden comment: 10K 1% 0603)
U11  MX25R3235FM1IH0  [SOIC-8]

### Ports
SPI (harness SPI)

### Harnesses
SPI: SCK, MOSI, MISO, CS2, CS1

### Nets
GND: C40.2 U11.4(GND)
VCC: C40.1 R61.2 U11.8(VCC)
SPI.CS2: R61.1 U11.1(CS) ; port SPI.CS2
SPI.MISO: U11.2(SO) ; port SPI.MISO
SPI.MOSI: U11.5(SI) ; port SPI.MOSI
SPI.SCK: U11.6(SCLK) ; port SPI.SCK

Not connected (* = marked no-connect by the designer): U11 3(WP) 7(RESET)

### Library data of the parts
C40 = CAP_0.1uF_6.3V_0603_10%: as C2 on sheet MCU; Mounting Technology: Surface Mount; PackageReference: 0603; PackageDescription: 0603 (1608 Metric); Voltage: 6.3V; Tolerance: 10%
R61 = RES_10K_0603_1%: as R1 on sheet MCU; Tolerance: 1%; Power: 0.25W; Mounting Technology: Surface Mount; PackageReference: 0603; PackageDescription: 0603 (1608 Metric); ComponentLink1Description: Datasheet; ComponentLink1URL: http://www.vishay.com/docs/20065/rcse3.pdf
U11 = MX25R3235FM1IH0: IC FLASH 32M(4M x 8) SPI 80MHZ 8SOP; Manufacturer: Macronix; PartNumber: MX25R3235FM1IH0; Mounting Technology: Surface Mount; PackageReference: SOP-8

## Sheet USB.SchDoc
size A4
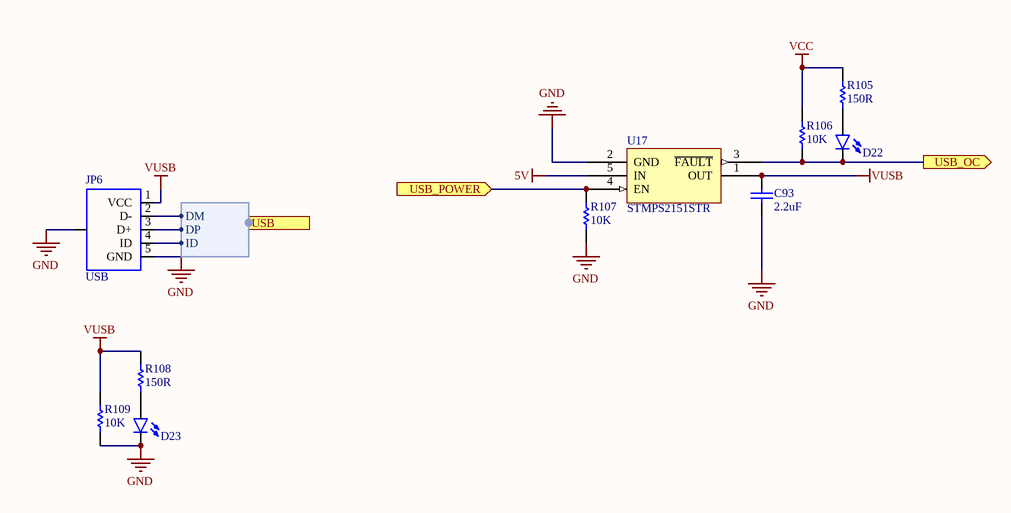
[diagram p7: USB.SchDoc]

### Parts
(Parts that share a designator on the sheet are numbered #1, #2 ... from top to bottom, then left to right.)
C93  value 2.2uF  [C1206[3216X160]]  (hidden comment: 2.2uF 16V 1206)
D22  USB_OC  [LED0603]  (value not drawn)
D23  USB_PW  [LED0603]  (value not drawn)
JP6#2  USB  [USB_MICROB_VERT]
R105  value 150R  [R0603[1608]]  (hidden comment: 150R 1% 0603)
R106  value 10K  [R0603[1608]]  (hidden comment: 10K 1% 0603)
R107  value 10K  [R0603[1608]]  (hidden comment: 10K 1% 0603)
R108  value 150R  [R0603[1608]]  (hidden comment: 150R 1% 0603)
R109  value 10K  [R0603[1608]]  (hidden comment: 10K 1% 0603)
U17  STMPS2151STR  [SOT-23-5L]

### Ports
USB (harness USB), USB_OC (out), USB_POWER (in)

### Harnesses
USB: DM, DP, ID

### Nets
5V: U17.5(IN)
GND: C93.2 D23.C JP6#2.5(GND) JP6#2.6(SHIELD) R107.1 R109.1 U17.2(GND)
VCC: R105.2 R106.2
VUSB: C93.1 JP6#2.1(VCC) R108.2 R109.2 U17.1(OUT)
NetD22_A: D22.A R105.1
NetD22_C: D22.C R106.1 U17.3(~{FAULT}) ; port USB_OC
NetD23_A: D23.A R108.1
NetJP6#2_2: JP6#2.2(D-) ; port USB.DM
NetJP6#2_3: JP6#2.3(D+) ; port USB.DP
NetJP6#2_4: JP6#2.4(ID) ; port USB.ID
NetR107_2: R107.2 U17.4(EN) ; port USB_POWER

### Library data of the parts
C93 = CAP_2.2uF_16V_1206_10%: 2.2uF 16V 10% X7R 1206 (3216 Metric); PartNumber: C1206C225K4RACAUTO; Manufacturer: KEMET; Mounting Technology: Surface Mount; PackageReference: 1206; PackageDescription: 1206 (3216 Metric); Voltage: 16V; Tolerance: 10%
D22 D23 = LED_0603_GREEN_5mA: as D13 on sheet 3V3; PackageReference: 0603; PackageDescription: 0603 (1608 Metric); Mounting Technology: Surface Mount
JP6#2 = USB_MICROB_VERT: PartNumber: 614105150721; Manufacturer: Wurth Electronics; Mounting Technology: Through Hole; PackageReference: USB - Micro B
R105 R108 = RES_150R_0603_1%: as R37 on sheet 3V3; Tolerance: 1%; Power: 0.25W; Mounting Technology: Surface Mount; PackageReference: 0603; PackageDescription: 0603 (1608 Metric); ComponentLink1Description: Datasheet; ComponentLink1URL: http://www.vishay.com/docs/20043/crcwhpe3.pdf
R106 R107 R109 = RES_10K_0603_1%: as R1 on sheet MCU; Tolerance: 1%; Power: 0.25W; Mounting Technology: Surface Mount; PackageReference: 0603; PackageDescription: 0603 (1608 Metric); ComponentLink1Description: Datasheet; ComponentLink1URL: http://www.vishay.com/docs/20065/rcse3.pdf
U17 = STMPS2141STR

## Nets that join several sheets
5V: 3V3 (D10.2 D12.1), Connectors (JP2.1), USB (U17.5)
BAT: 3V3 (C5.2 D1.1 MP1.3 U3.5), Switches (C1.2 Q3.3 R3.2), Connectors (JP2.2 JP5.2 SWITCH1.4)
CHG: 3V3 (D10.1 D11.1 MP1.1 R18.2), Switches (R5.2)
GND: 3V3 (19 pins), MCU (24 pins), Switches (6 pins), Connectors (18 pins), Bluetooth (R84.2 U13.1), Flash (C40.2 U11.4), USB (7 pins)
VCC: 3V3 (5 pins), MCU (28 pins), Connectors (12 pins), Bluetooth (U13.15 U13.24), Flash (C40.1 R61.2 U11.8), USB (R105.2 R106.2)
VDD: 3V3 (C28.2 U6.4 U6.5), MCU (R22.2), Switches (Q3.2), Connectors (JP14.1 JP14.3)
VUSB: 3V3 (D11.2 D15.1), MCU (U1.42), Connectors (JP6#1.1), USB (5 pins)
NetC2_2: MCU (C2.2 U1.17), Connectors (JP3.2 R9.2 U2.3)
NetC15_2: MCU (Q1.1), Switches (Q12.1 R47.2), Connectors (C15.2 R2.2 SWITCH1.2)
NetC16_2: MCU (U1.24), Connectors (C16.2 JP8.2 R25.1)
NetD3_2: MCU (Q2.3), Connectors (D3.2 JP7.1)
NetD22_C: MCU (U1.34), USB (D22.C R106.1 U17.3)
NetJP1_3: MCU (U1.57), Connectors (JP1.3)
NetJP1_8: MCU (U1.16), Connectors (JP1.8)
NetQ4_1: MCU (U1.54), Switches (Q4.1 R4.2 R5.1)
NetQ11_1: MCU (U1.36), Switches (Q11.1 R45.2)
NetR10_1: 3V3 (R10.1 U3.7), MCU (U1.33)
USB.DM: MCU (R11.1), Connectors (JP6#1.2)
USB.DP: MCU (R12.1), Connectors (JP6#1.3)
USB.ID: MCU (U1.43), Connectors (JP6#1.4)